# Altium schematic sheet USB_TTL.SchDoc
size 297 x 209 mm; SheetNumber: 27; SheetTotal: 29
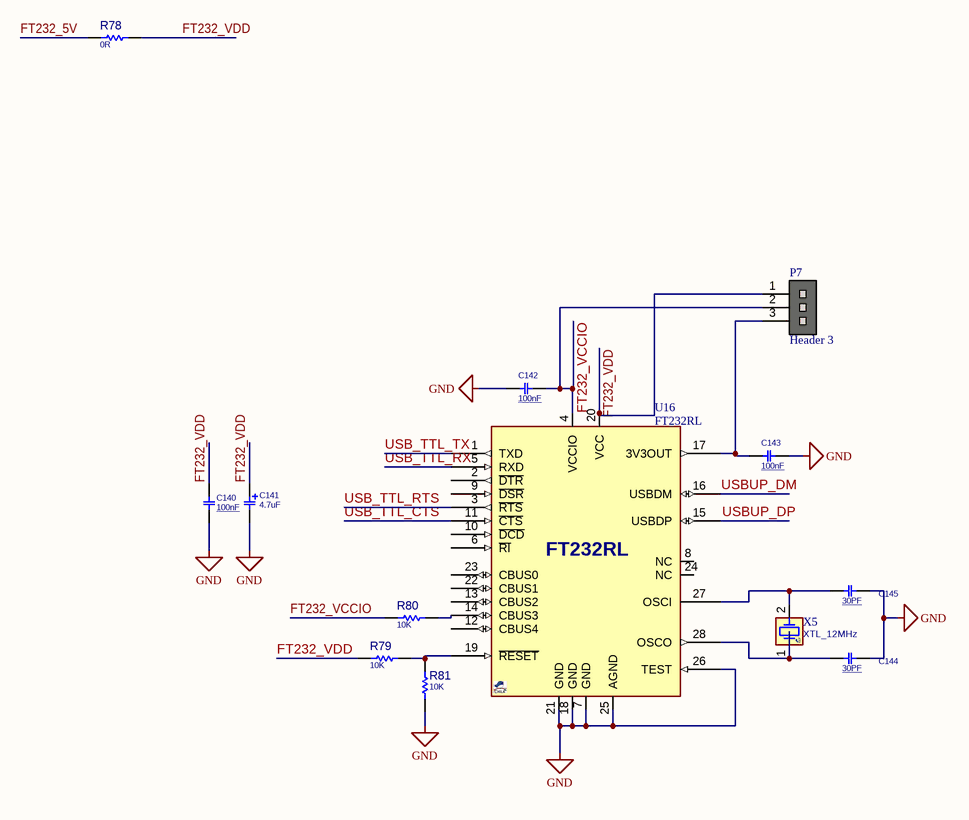
[diagram p0: USB_TTL.SchDoc]

## Parts
C140  100nF  [0603]
C141  4.7uF  [C_TN_3216]
C142  100nF  [0603]
C143  100nF  [0603]
C144  30PF  [C0805]
C145  30PF  [C0805]
P7  Header 3  [HDR 1X3]
R78  0R  [R0603]
R79  10K  [R0603]
R80  10K  [R0603]
R81  10K  [R0603]
U16  FT232RL  [SOG65_28_W]
X5  XTL_12MHz  [XTL_2_11X5]

## Nets
GND: C140.2 C141.2 C142.1 C143.2 C144.2 C145.2 R81.2 U16.7(GND) U16.18(GND) U16.21(GND) U16.25(AGND) U16.26(TEST)
FT232_5V: R78.1
FT232_VCCIO: C142.2 P7.2 R80.2 U16.4(VCCIO)
FT232_VDD: C140.1 C141.1 P7.1 R78.2 R79.1 U16.20(VCC)
USB_TTL_CTS: U16.11(~{CTS})
USB_TTL_RTS: U16.3(~{RTS})
USB_TTL_RX: U16.5(RXD)
USB_TTL_TX: U16.1(TXD)
USBUP_DM: U16.16(USBDM)
USBUP_DP: U16.15(USBDP)
NetC143_1: C143.1 P7.3 U16.17(3V3OUT)
NetC144_1: C144.1 U16.28(OSCO) X5.1(OSC1)
NetC145_1: C145.1 U16.27(OSCI) X5.2(OSC2)
NetR79_2: R79.2 R81.1 U16.19(~{RESET})
NetR80_1: R80.1 U16.14(CBUS3)

Not connected (* = marked no-connect by the designer): U16 2(~{DTR}) 6(~{RI}) 8(NC) 9(~{DSR}) 10(~{DCD}) 12(CBUS4) 13(CBUS2) 22(CBUS1) 23(CBUS0) 24(NC)

## Notes on the sheet
- Drawn
- Name
- Date
- Drawing Title
- Checked
- Drawing No.
- Approved
- Size
- A4
- Ver.
- Rev.
- Sheet
- Of

## Library data of the parts
C140 C142 C143 = CAP_SMD_FILM_1u16v_1210: CAP, FILM, 1uF, 16V, Acryl, 20%, 1210; PARAM: Acrylic, MetallizedStacked, 20%, -40~85oC; MANF_P#: ECP-U1C105MA5; MANF: Panasonic; PRICE: 100= 36$; DESC: -; PARAM2: 16V; ASSEMBLY: ASSEMBLY; VALUE: 100nF
C141 = CAP_SMD_TAN_10uF_6.3V: CAP, SMD, TAN; PARAM: 20%, 300mOhm, -55~105oC; MANF: VISHAY; MANF_P#: T55A106M6R3C0300; PARAM2: 6.3V; PRICE: 0.46$; VALUE: 4.7uF
C144 C145 = CAP_SMD_MLCC: CAP, MLCC, 1nF, 50V, C0G, 10%, 0402; MANF: Murata; PARAM: C0G, 10%; PRICE: 100= 1.4$; DESC: -; MANF_P#: -; PARAM2: 50V; ASSEMBLY: ASSEMBLY; VALUE: 30PF
P7 = Header 3: Header, 3-Pin; ComponentLinkp-URL: https://www.smartw.ir/; DatasheetVersion: 2020
R78-R81 = RES_SMD_0603: RESISTOR, SMD; PARAM: -W; DESC: DESCRIPTION; DIST#: MOUSER; PARAM2: 1%; MANF_P#: -; MANF: -; ASSEMBLY: ASSEMBLY; PRICE: 100= 0.5$
  R78: VALUE: 0R
  R79-R81: VALUE: 10K
U16 = FT232RL_SSOP28: USB-UART, Asynchronous Serial Data Transfer Chip, SSOP-28; MANF: FTDI; PARAM2: 3.3~5.25Vcc, 1.8~5.25VIO; MANF_P#: FT232RL; VALUE: FT232RL
X5 = XTL_2_HC49_8MHz_SMD: Crystal MOST POPULAR ABL HC49 PACKAGE; MANF: ABRACON; MANF_P#: ABLS-8.000MHZ-B4-T; PARAM: 8MHz, 18pF, 30PPM, -20~70oC; PRICE: 0.3$; VALUE: XTL_12MHz